# Altium schematic sheet LPDDR3.SchDoc
size A3; SheetNumber: 2; SheetTotal: 10
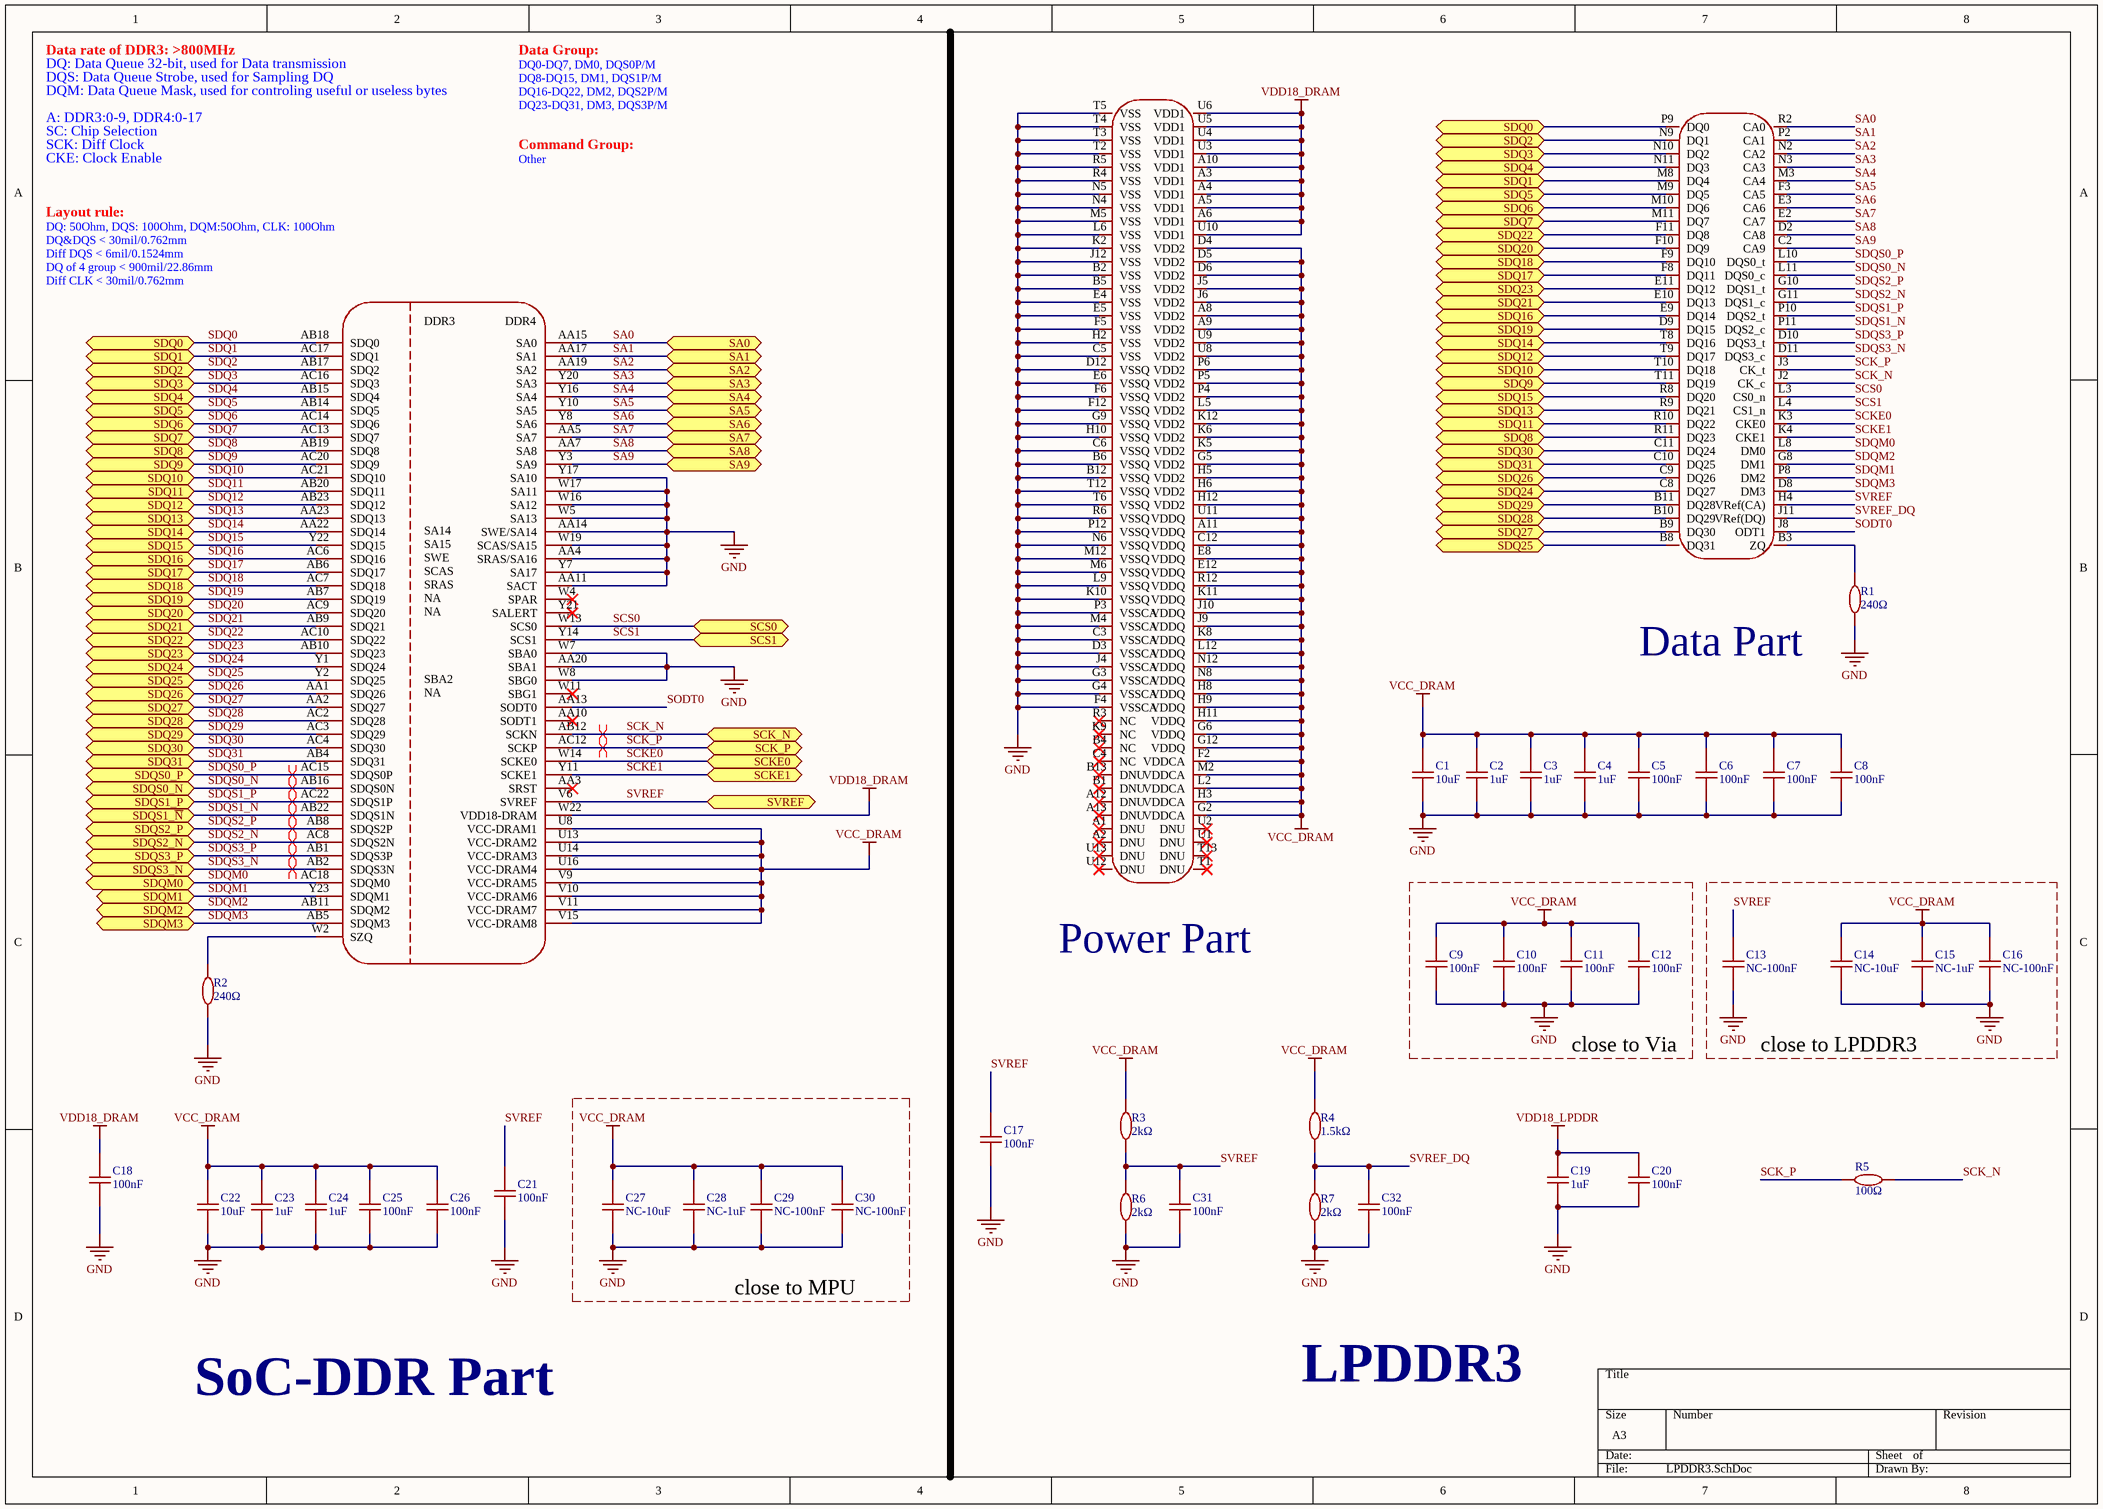
[diagram p0: LPDDR3.SchDoc]

## Parts
C1  10uF  [C0603]
C2  1uF  [C0402]
C3  1uF  [C0402]
C4  1uF  [C0402]
C5  100nF  [C0402]
C6  100nF  [C0402]
C7  100nF  [C0402]
C8  100nF  [C0402]
C9  100nF  [C0402]
C10  100nF  [C0402]
C11  100nF  [C0402]
C12  100nF  [C0402]
C13  NC-100nF  [C0402]
C14  NC-10uF  [C0603]
C15  NC-1uF  [C0402]
C16  NC-100nF  [C0402]
C17  100nF  [C0402]
C18  100nF  [C0402]
C19  1uF  [C0402]
C20  100nF  [C0402]
C21  100nF  [C0402]
C22  10uF  [C0603]
C23  1uF  [C0402]
C24  1uF  [C0402]
C25  100nF  [C0402]
C26  100nF  [C0402]
C27  NC-10uF  [C0603]
C28  NC-1uF  [C0402]
C29  NC-100nF  [C0402]
C30  NC-100nF  [C0402]
C31  100nF  [C0402]
C32  100nF  [C0402]
R1  240Ω  [R0402]
R2  240Ω  [R0402]
R3  2kΩ  [R0402]
R4  1.5kΩ  [R0402]
R5  100Ω  [R0402]
R6  2kΩ  [R0402]
R7  2kΩ  [R0402]
U1  LPDDR3-2G  [FBGA-178_L11.5-W11.0_K4E6E304EC-TL]  (value not drawn)  (parts A,B of 2)
U2  Allwinner_H6  [BGA451_ALLWINNER_H6]  (value not drawn)  (part A of 4)

## Blocks framed on the sheet
close to Via: C9-C12
close to LPDDR3: C13-C16
close to MPU: C27-C30

## Ports
SA0 (bidir), SA1 (bidir), SA2 (bidir), SA3 (bidir), SA4 (bidir), SA5 (bidir), SA6 (bidir), SA7 (bidir), SA8 (bidir), SA9 (bidir), SCK_N (bidir), SCK_P (bidir), SCKE0 (bidir), SCKE1 (bidir), SCS0 (bidir), SCS1 (bidir), SDQ0 (bidir, see LPDDR3[1A]), SDQ0 (bidir, see LPDDR3[6A]), SDQ1 (bidir, see LPDDR3[1A]), SDQ1 (bidir, see LPDDR3[6A]), SDQ2 (bidir, see LPDDR3[1A]), SDQ2 (bidir, see LPDDR3[6A]), SDQ3 (bidir, see LPDDR3[1B]), SDQ3 (bidir, see LPDDR3[6A]), SDQ4 (bidir, see LPDDR3[1B]), SDQ4 (bidir, see LPDDR3[6A]), SDQ5 (bidir, see LPDDR3[1B]), SDQ5 (bidir, see LPDDR3[6A]), SDQ6 (bidir, see LPDDR3[1B]), SDQ6 (bidir, see LPDDR3[6A]), SDQ7 (bidir, see LPDDR3[1B]), SDQ7 (bidir, see LPDDR3[6A]), SDQ8 (bidir, see LPDDR3[1B]), SDQ8 (bidir, see LPDDR3[6B]), SDQ9 (bidir, see LPDDR3[1B]), SDQ9 (bidir, see LPDDR3[6B]), SDQ10 (bidir, see LPDDR3[1B]), SDQ10 (bidir, see LPDDR3[6A]), SDQ11 (bidir, see LPDDR3[1B]), SDQ11 (bidir, see LPDDR3[6B]), SDQ12 (bidir, see LPDDR3[1B]), SDQ12 (bidir, see LPDDR3[6A]), SDQ13 (bidir, see LPDDR3[1B]), SDQ13 (bidir, see LPDDR3[6B]), SDQ14 (bidir, see LPDDR3[1B]), SDQ14 (bidir, see LPDDR3[6A]), SDQ15 (bidir, see LPDDR3[1B]), SDQ15 (bidir, see LPDDR3[6B]), SDQ16 (bidir, see LPDDR3[1B]), SDQ16 (bidir, see LPDDR3[6A]), SDQ17 (bidir, see LPDDR3[1B]), SDQ17 (bidir, see LPDDR3[6A]), SDQ18 (bidir, see LPDDR3[1B]), SDQ18 (bidir, see LPDDR3[6A]), SDQ19 (bidir, see LPDDR3[1B]), SDQ19 (bidir, see LPDDR3[6A]), SDQ20 (bidir, see LPDDR3[1B]), SDQ20 (bidir, see LPDDR3[6A]), SDQ21 (bidir, see LPDDR3[1B]), SDQ21 (bidir, see LPDDR3[6A]), SDQ22 (bidir, see LPDDR3[1B]), SDQ22 (bidir, see LPDDR3[6A]), SDQ23 (bidir, see LPDDR3[1B]), SDQ23 (bidir, see LPDDR3[6A]), SDQ24 (bidir, see LPDDR3[1B]), SDQ24 (bidir, see LPDDR3[6B]), SDQ25 (bidir, see LPDDR3[1B]), SDQ25 (bidir, see LPDDR3[6B]), SDQ26 (bidir, see LPDDR3[1B]), SDQ26 (bidir, see LPDDR3[6B]), SDQ27 (bidir, see LPDDR3[1B]), SDQ27 (bidir, see LPDDR3[6B]), SDQ28 (bidir, see LPDDR3[1B]), SDQ28 (bidir, see LPDDR3[6B]), SDQ29 (bidir, see LPDDR3[1B]), SDQ29 (bidir, see LPDDR3[6B]), SDQ30 (bidir, see LPDDR3[1B]), SDQ30 (bidir, see LPDDR3[6B]), SDQ31 (bidir, see LPDDR3[1C]), SDQ31 (bidir, see LPDDR3[6B]), SDQM0 (bidir), SDQM1 (bidir), SDQM2 (bidir), SDQM3 (bidir), SDQS0_N (bidir), SDQS0_P (bidir), SDQS1_P (bidir), SDQS1_~{N} (bidir), SDQS2_N (bidir), SDQS2_P (bidir), SDQS3_N (bidir), SDQS3_P (bidir), SVREF (bidir)

## Nets
GND: C1.1 C2.1 C3.1 C4.1 C5.1 C6.1 C7.1 C8.1 C9.1 C10.1 C11.1 C12.1 C13.1 C14.1 C15.1 C16.1 C17.1 C18.1 C19.1 C20.1 C21.1 C22.1 C23.1 C24.1 C25.1 C26.1 C27.1 C28.1 C29.1 C30.1 C31.1 C32.1 R1.1 R2.1 R6.1 R7.1 U1.B2(VSS) U1.B5(VSS) U1.B6(VSSQ) U1.B12(VSSQ) U1.C3(VSSCA) U1.C5(VSS) U1.C6(VSSQ) U1.D3(VSSCA) U1.D12(VSSQ) U1.E4(VSS) U1.E5(VSS) U1.E6(VSSQ) U1.F4(VSSCA) U1.F5(VSS) U1.F6(VSSQ) U1.F12(VSSQ) U1.G3(VSSCA) U1.G4(VSSCA) U1.G9(VSSQ) U1.H2(VSS) U1.H10(VSSQ) U1.J4(VSSCA) U1.J12(VSS) U1.K2(VSS) U1.K10(VSSQ) U1.L6(VSS) U1.L9(VSSQ) U1.M4(VSSCA) U1.M5(VSS) U1.M6(VSSQ) U1.M12(VSSQ) U1.N4(VSS) U1.N5(VSS) U1.N6(VSSQ) U1.P3(VSSCA) U1.P12(VSSQ) U1.R4(VSS) U1.R5(VSS) U1.R6(VSSQ) U1.T2(VSS) U1.T3(VSS) U1.T4(VSS) U1.T5(VSS) U1.T6(VSSQ) U1.T12(VSSQ) U2.AA4(SRAS/SA16) U2.AA11(SACT) U2.AA14(SWE/SA14) U2.AA20(SBA1) U2.W5(SA13) U2.W7(SBA0) U2.W8(SBG0) U2.W16(SA12) U2.W17(SA11) U2.W19(SCAS/SA15) U2.Y7(SA17) U2.Y17(SA10)
VCC_DRAM: C1.2 C2.2 C3.2 C4.2 C5.2 C6.2 C7.2 C8.2 C9.2 C10.2 C11.2 C12.2 C14.2 C15.2 C16.2 C22.2 C23.2 C24.2 C25.2 C26.2 C27.2 C28.2 C29.2 C30.2 R3.2 R4.2 U1.A8(VDD2) U1.A9(VDD2) U1.A11(VDDQ) U1.C12(VDDQ) U1.D4(VDD2) U1.D5(VDD2) U1.D6(VDD2) U1.E8(VDDQ) U1.E12(VDDQ) U1.F2(VDDCA) U1.G2(VDDCA) U1.G5(VDD2) U1.G6(VDDQ) U1.G12(VDDQ) U1.H3(VDDCA) U1.H5(VDD2) U1.H6(VDD2) U1.H8(VDDQ) U1.H9(VDDQ) U1.H11(VDDQ) U1.H12(VDD2) U1.J5(VDD2) U1.J6(VDD2) U1.J9(VDDQ) U1.J10(VDDQ) U1.K5(VDD2) U1.K6(VDD2) U1.K8(VDDQ) U1.K11(VDDQ) U1.K12(VDD2) U1.L2(VDDCA) U1.L5(VDD2) U1.L12(VDDQ) U1.M2(VDDCA) U1.N8(VDDQ) U1.N12(VDDQ) U1.P4(VDD2) U1.P5(VDD2) U1.P6(VDD2) U1.R12(VDDQ) U1.U8(VDD2) U1.U9(VDD2) U1.U11(VDDQ) U2.U8(VCC-DRAM1) U2.U13(VCC-DRAM2) U2.U14(VCC-DRAM3) U2.U16(VCC-DRAM4) U2.V9(VCC-DRAM5) U2.V10(VCC-DRAM6) U2.V11(VCC-DRAM7) U2.V15(VCC-DRAM8)
VDD18_DRAM: C18.2 U1.A3(VDD1) U1.A4(VDD1) U1.A5(VDD1) U1.A6(VDD1) U1.A10(VDD1) U1.U3(VDD1) U1.U4(VDD1) U1.U5(VDD1) U1.U6(VDD1) U1.U10(VDD1) U2.W22(VDD18-DRAM)
VDD18_LPDDR: C19.2 C20.2
SA0: U1.R2(CA0) U2.AA15(SA0) ; port SA0
SA1: U1.P2(CA1) U2.AA17(SA1) ; port SA1
SA2: U1.N2(CA2) U2.AA19(SA2) ; port SA2
SA3: U1.N3(CA3) U2.Y20(SA3) ; port SA3
SA4: U1.M3(CA4) U2.Y16(SA4) ; port SA4
SA5: U1.F3(CA5) U2.Y10(SA5) ; port SA5
SA6: U1.E3(CA6) U2.Y8(SA6) ; port SA6
SA7: U1.E2(CA7) U2.AA5(SA7) ; port SA7
SA8: U1.D2(CA8) U2.AA7(SA8) ; port SA8
SA9: U1.C2(CA9) U2.Y3(SA9) ; port SA9
SCK_N: R5.2 U1.J2(CK_c) U2.AB12(SCKN) ; port SCK_N
SCK_P: R5.1 U1.J3(CK_t) U2.AC12(SCKP) ; port SCK_P
SCKE0: U1.K3(CKE0) U2.W14(SCKE0) ; port SCKE0
SCKE1: U1.K4(CKE1) U2.Y11(SCKE1) ; port SCKE1
SCS0: U1.L3(CS0_n) U2.W13(SCS0) ; port SCS0
SCS1: U1.L4(CS1_n) U2.Y14(SCS1) ; port SCS1
SDQ0: U1.P9(DQ0) U2.AB18(SDQ0) ; port SDQ0
SDQ1: U1.M8(DQ4) U2.AC17(SDQ1) ; port SDQ1
SDQ2: U1.N9(DQ1) U2.AB17(SDQ2) ; port SDQ2
SDQ3: U1.N10(DQ2) U2.AC16(SDQ3) ; port SDQ3
SDQ4: U1.N11(DQ3) U2.AB15(SDQ4) ; port SDQ4
SDQ5: U1.M9(DQ5) U2.AB14(SDQ5) ; port SDQ5
SDQ6: U1.M10(DQ6) U2.AC14(SDQ6) ; port SDQ6
SDQ7: U1.M11(DQ7) U2.AC13(SDQ7) ; port SDQ7
SDQ8: U1.R11(DQ23) U2.AB19(SDQ8) ; port SDQ8
SDQ9: U1.T11(DQ19) U2.AC20(SDQ9) ; port SDQ9
SDQ10: U1.T10(DQ18) U2.AC21(SDQ10) ; port SDQ10
SDQ11: U1.R10(DQ22) U2.AB20(SDQ11) ; port SDQ11
SDQ12: U1.T9(DQ17) U2.AB23(SDQ12) ; port SDQ12
SDQ13: U1.R9(DQ21) U2.AA23(SDQ13) ; port SDQ13
SDQ14: U1.T8(DQ16) U2.AA22(SDQ14) ; port SDQ14
SDQ15: U1.R8(DQ20) U2.Y22(SDQ15) ; port SDQ15
SDQ16: U1.E9(DQ14) U2.AC6(SDQ16) ; port SDQ16
SDQ17: U1.F8(DQ11) U2.AB6(SDQ17) ; port SDQ17
SDQ18: U1.F9(DQ10) U2.AC7(SDQ18) ; port SDQ18
SDQ19: U1.D9(DQ15) U2.AB7(SDQ19) ; port SDQ19
SDQ20: U1.F10(DQ9) U2.AC9(SDQ20) ; port SDQ20
SDQ21: U1.E10(DQ13) U2.AB9(SDQ21) ; port SDQ21
SDQ22: U1.F11(DQ8) U2.AC10(SDQ22) ; port SDQ22
SDQ23: U1.E11(DQ12) U2.AB10(SDQ23) ; port SDQ23
SDQ24: U1.C8(DQ27) U2.Y1(SDQ24) ; port SDQ24
SDQ25: U1.B8(DQ31) U2.Y2(SDQ25) ; port SDQ25
SDQ26: U1.C9(DQ26) U2.AA1(SDQ26) ; port SDQ26
SDQ27: U1.B9(DQ30) U2.AA2(SDQ27) ; port SDQ27
SDQ28: U1.B10(DQ29) U2.AC2(SDQ28) ; port SDQ28
SDQ29: U1.B11(DQ28) U2.AC3(SDQ29) ; port SDQ29
SDQ30: U1.C11(DQ24) U2.AC4(SDQ30) ; port SDQ30
SDQ31: U1.C10(DQ25) U2.AB4(SDQ31) ; port SDQ31
SDQM0: U1.L8(DM0) U2.AC18(SDQM0) ; port SDQM0
SDQM1: U1.P8(DM2) U2.Y23(SDQM1) ; port SDQM1
SDQM2: U1.G8(DM1) U2.AB11(SDQM2) ; port SDQM2
SDQM3: U1.D8(DM3) U2.AB5(SDQM3) ; port SDQM3
SDQS0_N: U1.L11(DQS0_c) U2.AB16(SDQS0N) ; port SDQS0_N
SDQS0_P: U1.L10(DQS0_t) U2.AC15(SDQS0P) ; port SDQS0_P
SDQS1_N: U1.P11(DQS2_c) U2.AB22(SDQS1N) ; port SDQS1_~{N}
SDQS1_P: U1.P10(DQS2_t) U2.AC22(SDQS1P) ; port SDQS1_P
SDQS2_N: U1.G11(DQS1_c) U2.AC8(SDQS2N) ; port SDQS2_N
SDQS2_P: U1.G10(DQS1_t) U2.AB8(SDQS2P) ; port SDQS2_P
SDQS3_N: U1.D11(DQS3_c) U2.AB2(SDQS3N) ; port SDQS3_N
SDQS3_P: U1.D10(DQS3_t) U2.AB1(SDQS3P) ; port SDQS3_P
SODT0: U1.J8(ODT1) U2.AA13(SODT0)
SVREF: C13.2 C17.2 C21.2 C31.2 R3.1 R6.2 U1.H4(VRef(CA)) U2.V6(SVREF) ; port SVREF
SVREF_DQ: C32.2 R4.1 R7.2 U1.J11(VRef(DQ))
NetR1_2: R1.2 U1.B3(ZQ)
NetR2_2: R2.2 U2.W2(SZQ)

Not connected (* = marked no-connect by the designer): U1 A1(DNU)* A2(DNU)* A12(DNU)* A13(DNU)* B1(DNU)* B4(NC)* B13(DNU)* C4(NC)* K9(NC)* R3(NC)* T1(DNU)* T13(DNU)* U1(DNU)* U2(DNU)* U12(DNU)* U13(DNU)*; U2 AA3(SRST)* AA10(SODT1)* W4(SPAR)* W11(SBG1)* Y21(SALERT)*

## Layout directives
differential pair: SCK_N, SCK_P, SDQS0_N, SDQS0_P, SDQS1_N, SDQS1_P, SDQS2_N, SDQS2_P, SDQS3_N, SDQS3_P

## Notes on the sheet
- DQ: Data Queue 32-bit, used for Data transmission
- DQS: Data Queue Strobe, used for Sampling DQ
- Data rate of DDR3: >800MHz
- DQM: Data Queue Mask, used for controling useful or useless bytes
- DQ0-DQ7, DM0, DQS0P/M
- Data Group:
- DQ8-DQ15, DM1, DQS1P/M
- DQ16-DQ22, DM2, DQS2P/M
- DQ23-DQ31, DM3, DQS3P/M
- SC: Chip Selection
- A: DDR3:0-9, DDR4:0-17
- SCK: Diff Clock
- CKE: Clock Enable
- Other
- Command Group:
- DQ: 50Ohm, DQS: 100Ohm, DQM:50Ohm, CLK: 100Ohm
- DQ&DQS < 30mil/0.762mm
- Layout rule:
- Diff DQS < 6mil/0.1524mm
- DQ of 4 group < 900mil/22.86mm
- Diff CLK < 30mil/0.762mm
- (near R1) Data Part
- (near U1) Power Part
- LPDDR3
- SoC-DDR Part
- (in symbol Allwinner_H6, part A) DDR3; DDR4; SA14; SA15; SWE; SCAS; SRAS; NA; SBA2

## Library data of the parts
C1 C14 C22 C27 = 10uF: 10V 10uF X5R ±10% 0603 Ceramic Capacitors ROHS
C2-C4 C15 C19 C23 C24 C28 = 1uF: 50V 1uF X5R ±10% 0603 Ceramic Capacitors ROHS
C5-C13 C16-C18 C20 C21 C25 C26 C29 C30 = 100nF: 50V 100nF X7R ±10% 0603 Ceramic Capacitors ROHS
C31 C32 = 100nF: 50V 100nF X7R ±10% 0402 Ceramic Capacitors ROHS
R1 R2 = 240Ω: 240Ω 62.5mW 50V ±100ppm/℃ Thick Film Resistor ±1% 0402 Chip Resistor - Surface Mount ROHS
R3 R6 R7 = 2kΩ: 100mW 2kΩ 75V ±100ppm/℃ Thick Film Resistor ±1% 0402 Chip Resistor - Surface Mount ROHS
R4 = 1.5kΩ: 62.5mW 1.5kΩ 50V ±100ppm/℃ Thick Film Resistor ±1% 0402 Chip Resistor - Surface Mount ROHS
R5 = 100Ω: 100Ω 62.5mW 50V ±100ppm/℃ Thick Film Resistor ±1% 0402 Chip Resistor - Surface Mount ROHS
U1 = LPDDR3-2G: Manufacturer: SAMSUNG(三星半导体); Symbol: K4E6E304EC-EGCG; Add into BOM: yes; Device: LPDDR3-2G; LCSC Part Name: K4E6E304EC-EGCG; Supplier Part: C2803256; Manufacturer Part: K4E6E304EC-EGCG; Supplier Footprint: SMD; JLCPCB Part Class: 扩展库; Datasheet: https://atta.szlcsc.comnull; Supplier: LCSC; Convert to PCB: yes
U2 = Allwinner_H6: Add into BOM: yes; Symbol: Allwinner_H6; Device: Allwinner_H6; Convert to PCB: yes